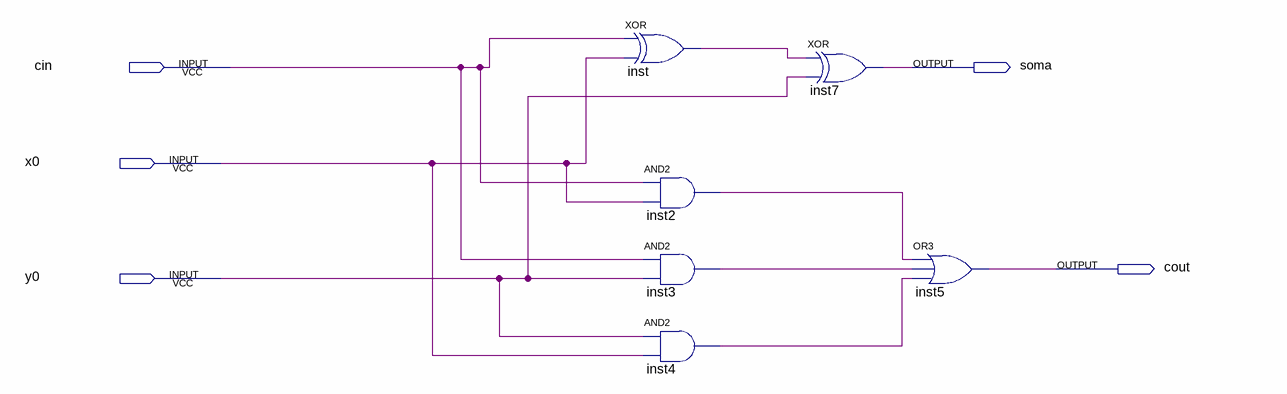
[diagram p0: schematic sheet]
// Quartus schematic fa.bdf as structural Verilog: 6 symbols, 5 pins
module fa (
  input  cin,
  input  x0,
  input  y0,
  output soma,
  output cout
);

  wire inst2_out, inst3_out, inst4_out, inst_out;

  xor inst (inst_out, cin, x0);
  and inst2 (inst2_out, cin, x0);
  and inst3 (inst3_out, cin, y0);
  and inst4 (inst4_out, y0, x0);
  xor inst7 (soma, inst_out, y0);
  or inst5 (cout, inst2_out, inst3_out, inst4_out);
endmodule
